# EAGLE board testtool (EAGLE 9.5.2)
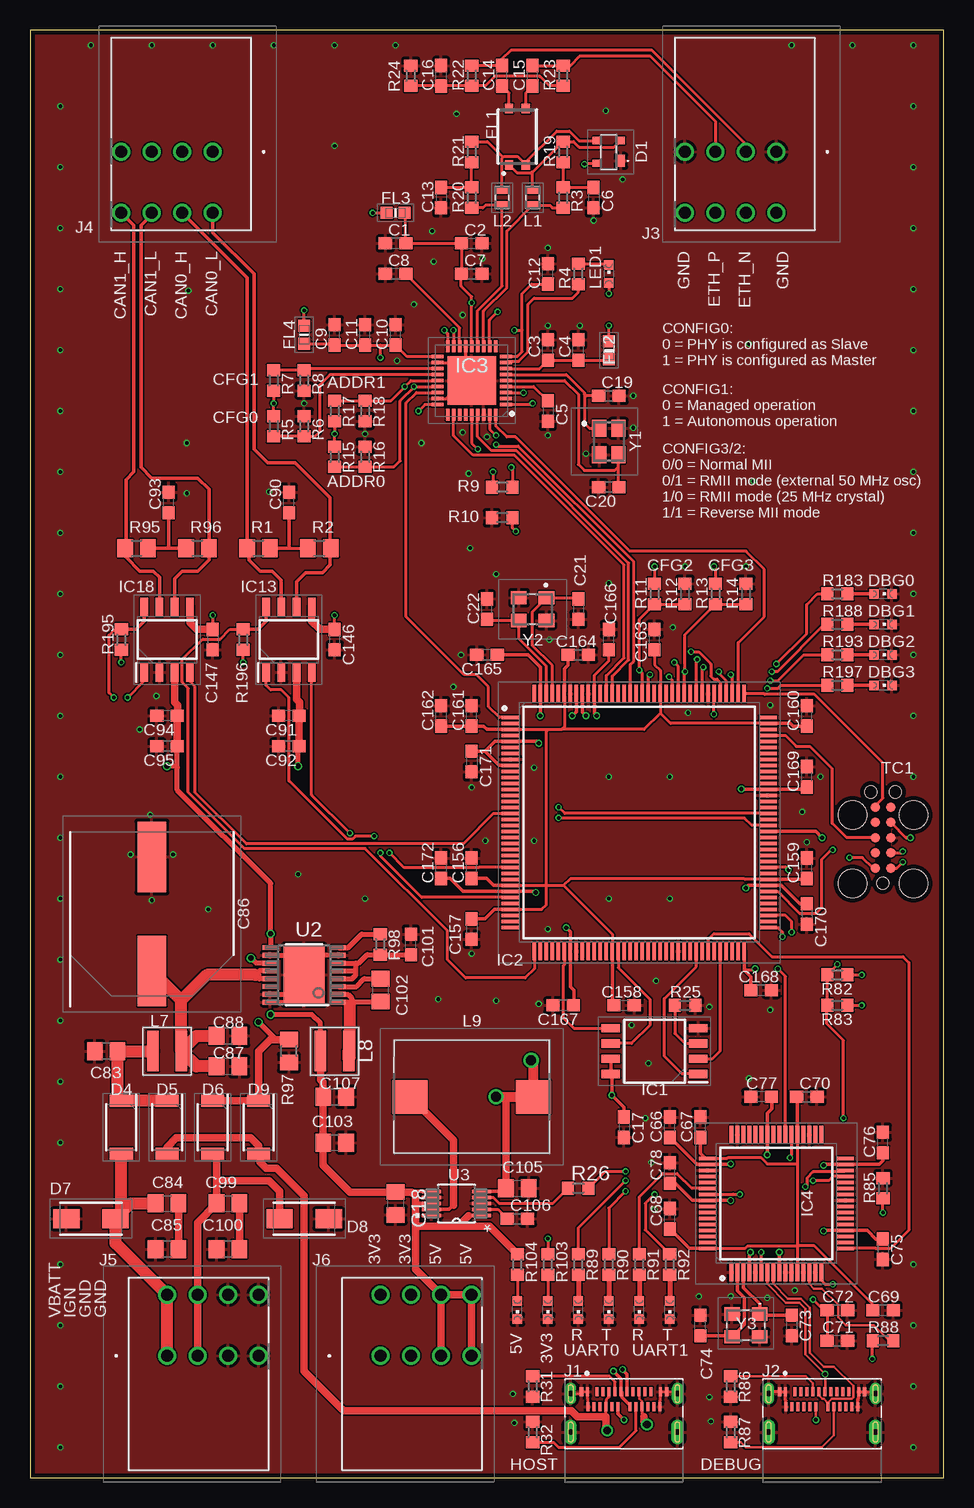
[diagram p7: board, top side]
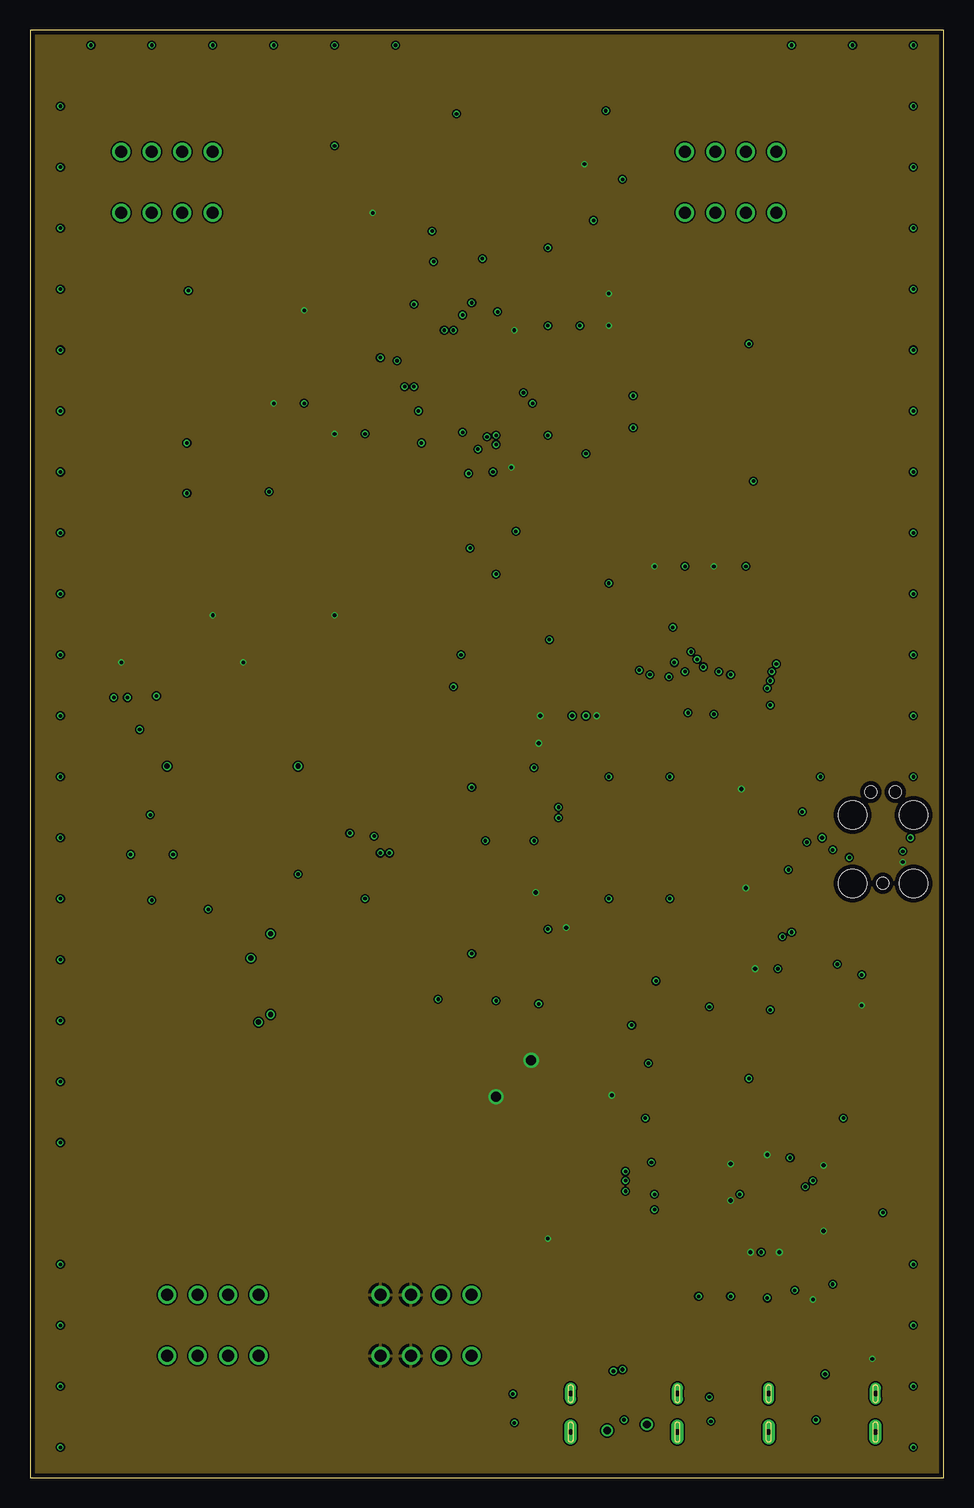
[diagram p8: board, inner layer Route2]
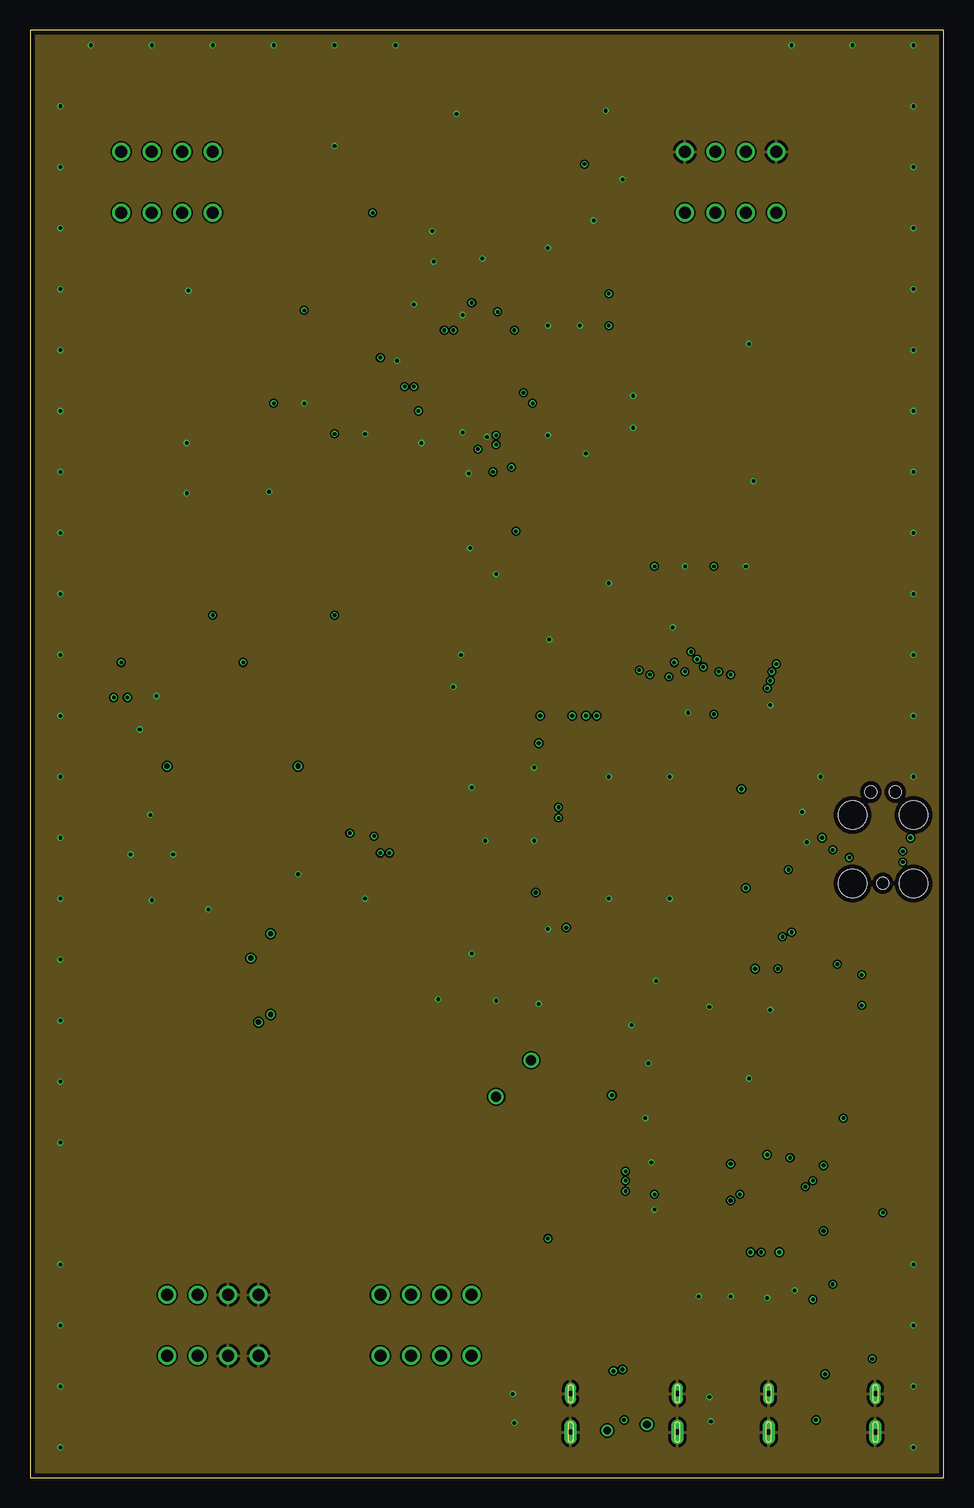
[diagram p9: board, inner layer Route15]
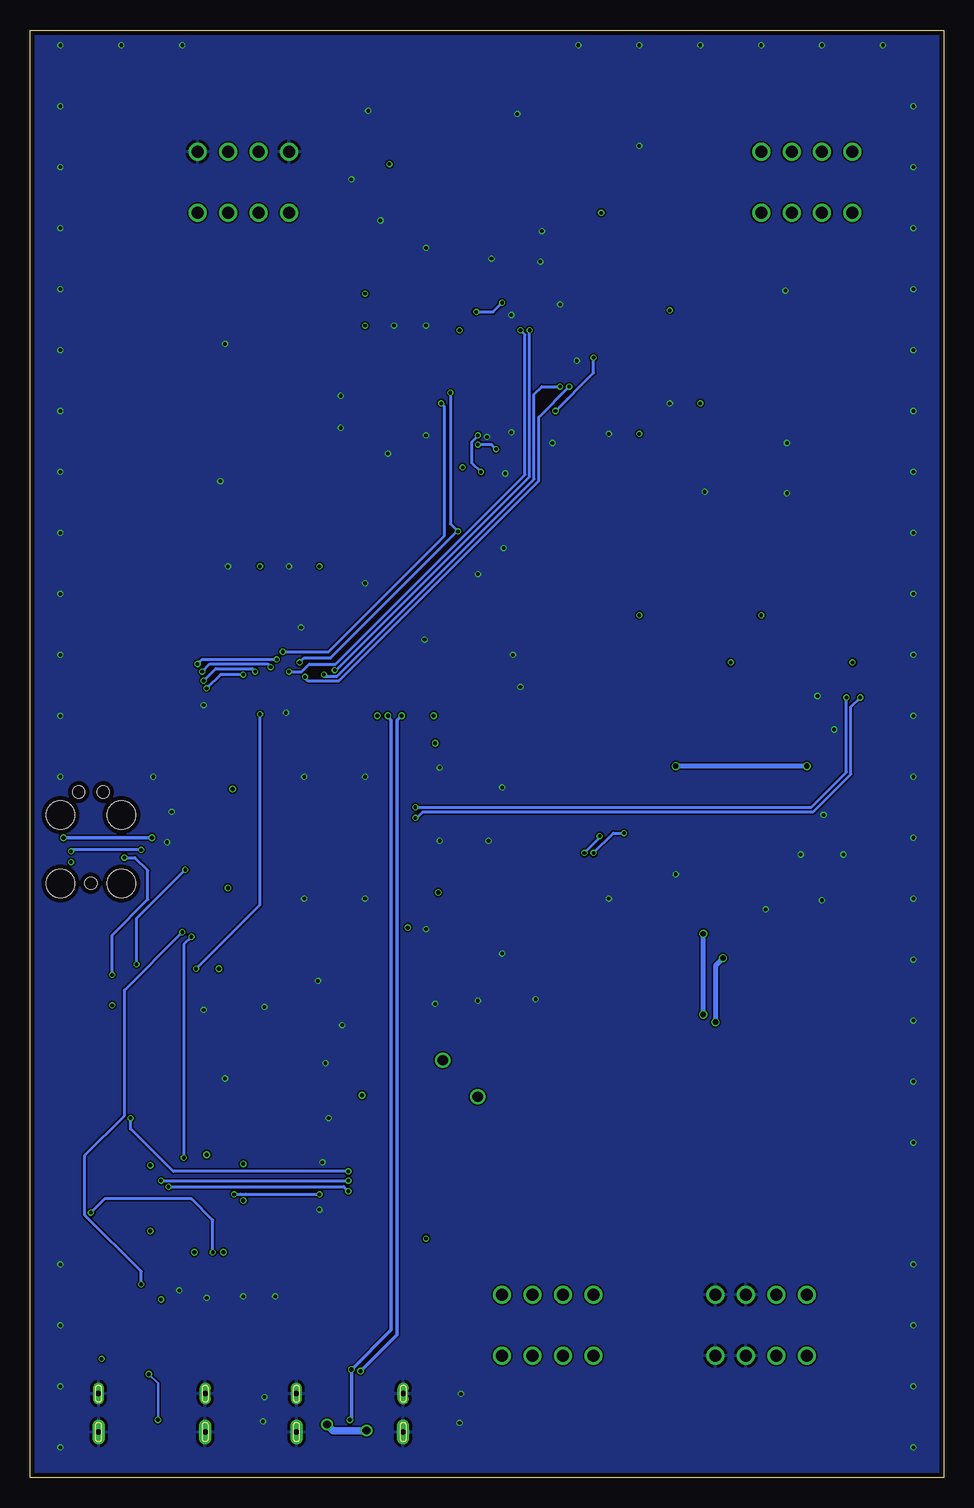
[diagram p10: board, bottom side, seen from below]

Size 76.2 x 120.65 mm. Coordinates in mm from the lower left corner, seen from the top.
Outline: 0,0 76.2,0 76.2,120.65 0,120.65 0,0
Copper layers (1*2*15*16): Top 0.035559375mm / dielectric 0.17018125mm / Route2 0.01778125mm / dielectric 47mil / Route15 0.01778125mm / dielectric 0.17018125mm / Bottom 0.035559375mm
Design rules "oshpark-4layer": minimum track width 5mil, minimum drill 10mil, track to track 5mil, track to pad 5mil, pad to pad 5mil, via to via 5mil, smd to smd 5mil, copper to edge 15mil, drill to drill 6mil, minimum pad ring 4mil, minimum via ring 4mil, stop-mask expansion 2.5mil, vias tented up to drill 0mil, thermal gap 10mil

## Footprints (pad centres in the part's own frame; a part is rotated, then mirrored left to right if it is on the bottom)
C0603 = smd 1.1 x 1: 1 -0.85,0; 2 0.85,0
C0805 = smd 1.3 x 1.5: 1 -0.95,0; 2 0.95,0
CAPAE1360X1450N = smd 5.9 x 2.4: 1 -4.75,0; 2 4.75,0
PESD2ETHAXR = smd 1 x 0.7: 1 -0.75,-1 | smd 0.6 x 0.7: 2 0.95,-1; 3 0.95,1; 4 -0.95,1
SODFL4725X110N = smd 1 x 1.93: 1 -2.2,0; 2 2.2,0
DIONM5127X229N = smd 2.2 x 1.55: 1 -2.05,0; 2 2.05,0
ACT45L_1 = smd 0.8 x 0.7: 1 -2.35,-0.7; 2 -2.35,0.7; 3 2.35,-0.7; 4 2.35,0.7
BEADC1608X95N = smd 1 x 1: 1 -0.75,0; 2 0.75,0
SOIC127P794X203-8N = smd 1.55 x 0.7: 1 -3.65,1.905; 2 -3.65,0.635; 3 -3.65,-0.635; 4 -3.65,-1.905; 5 3.65,-1.905; 6 3.65,-0.635; 7 3.65,0.635; 8 3.65,1.905
QFP50P2200X2200X160-144N = smd 1.475 x 0.3: 1 -10.738,8.75; 2 -10.738,8.25; 3 -10.738,7.75; 4 -10.738,7.25; 5 -10.738,6.75; 6 -10.738,6.25; 7 -10.738,5.75; 8 -10.738,5.25; 9 -10.738,4.75; 10 -10.738,4.25; 11 -10.738,3.75; 12 -10.738,3.25; 13 -10.738,2.75; 14 -10.738,2.25; 15 -10.738,1.75; 16 -10.738,1.25; 17 -10.738,0.75; 18 -10.738,0.25; 19 -10.738,-0.25; 20 -10.738,-0.75; 21 -10.738,-1.25; 22 -10.738,-1.75; 23 -10.738,-2.25; 24 -10.738,-2.75; 25 -10.738,-3.25; 26 -10.738,-3.75; 27 -10.738,-4.25; 28 -10.738,-4.75; 29 -10.738,-5.25; 30 -10.738,-5.75; 31 -10.738,-6.25; 32 -10.738,-6.75; 33 -10.738,-7.25; 34 -10.738,-7.75; 35 -10.738,-8.25; 36 -10.738,-8.75; 73 10.738,-8.75; 74 10.738,-8.25; 75 10.738,-7.75; 76 10.738,-7.25; 77 10.738,-6.75; 78 10.738,-6.25; 79 10.738,-5.75; 80 10.738,-5.25; 81 10.738,-4.75; 82 10.738,-4.25; 83 10.738,-3.75; 84 10.738,-3.25; 85 10.738,-2.75; 86 10.738,-2.25; 87 10.738,-1.75; 88 10.738,-1.25; 89 10.738,-0.75; 90 10.738,-0.25; 91 10.738,0.25; 92 10.738,0.75; 93 10.738,1.25; 94 10.738,1.75; 95 10.738,2.25; 96 10.738,2.75; 97 10.738,3.25; 98 10.738,3.75; 99 10.738,4.25; 100 10.738,4.75; 101 10.738,5.25; 102 10.738,5.75; 103 10.738,6.25; 104 10.738,6.75; 105 10.738,7.25; 106 10.738,7.75; 107 10.738,8.25; 108 10.738,8.75 | smd 0.3 x 1.475: 37 -8.75,-10.738; 38 -8.25,-10.738; 39 -7.75,-10.738; 40 -7.25,-10.738; 41 -6.75,-10.738; 42 -6.25,-10.738; 43 -5.75,-10.738; 44 -5.25,-10.738; 45 -4.75,-10.738; 46 -4.25,-10.738; 47 -3.75,-10.738; 48 -3.25,-10.738; 49 -2.75,-10.738; 50 -2.25,-10.738; 51 -1.75,-10.738; 52 -1.25,-10.738; 53 -0.75,-10.738; 54 -0.25,-10.738; 55 0.25,-10.738; 56 0.75,-10.738; 57 1.25,-10.738; 58 1.75,-10.738; 59 2.25,-10.738; 60 2.75,-10.738; 61 3.25,-10.738; 62 3.75,-10.738; 63 4.25,-10.738; 64 4.75,-10.738; 65 5.25,-10.738; 66 5.75,-10.738; 67 6.25,-10.738; 68 6.75,-10.738; 69 7.25,-10.738; 70 7.75,-10.738; 71 8.25,-10.738; 72 8.75,-10.738; 109 8.75,10.738; 110 8.25,10.738; 111 7.75,10.738; 112 7.25,10.738; 113 6.75,10.738; 114 6.25,10.738; 115 5.75,10.738; 116 5.25,10.738; 117 4.75,10.738; 118 4.25,10.738; 119 3.75,10.738; 120 3.25,10.738; 121 2.75,10.738; 122 2.25,10.738; 123 1.75,10.738; 124 1.25,10.738; 125 0.75,10.738; 126 0.25,10.738; 127 -0.25,10.738; 128 -0.75,10.738; 129 -1.25,10.738; 130 -1.75,10.738; 131 -2.25,10.738; 132 -2.75,10.738; 133 -3.25,10.738; 134 -3.75,10.738; 135 -4.25,10.738; 136 -4.75,10.738; 137 -5.25,10.738; 138 -5.75,10.738; 139 -6.25,10.738; 140 -6.75,10.738; 141 -7.25,10.738; 142 -7.75,10.738; 143 -8.25,10.738; 144 -8.75,10.738
QFN50P600X600X100-37N = smd 1 x 0.3: 1 -2.85,2; 2 -2.85,1.5; 3 -2.85,1; 4 -2.85,0.5; 5 -2.85,0; 6 -2.85,-0.5; 7 -2.85,-1; 8 -2.85,-1.5; 9 -2.85,-2; 19 2.85,-2; 20 2.85,-1.5; 21 2.85,-1; 22 2.85,-0.5; 23 2.85,0; 24 2.85,0.5; 25 2.85,1; 26 2.85,1.5; 27 2.85,2 | smd 0.3 x 1: 10 -2,-2.85; 11 -1.5,-2.85; 12 -1,-2.85; 13 -0.5,-2.85; 14 0,-2.85; 15 0.5,-2.85; 16 1,-2.85; 17 1.5,-2.85; 18 2,-2.85; 28 2,2.85; 29 1.5,2.85; 30 1,2.85; 31 0.5,2.85; 32 0,2.85; 33 -0.5,2.85; 34 -1,2.85; 35 -1.5,2.85; 36 -2,2.85 | smd 4.05 x 4.05: 37 0,0
QFP50P1200X1200X160-64N = smd 1.475 x 0.3: 1 -5.738,3.75; 2 -5.738,3.25; 3 -5.738,2.75; 4 -5.738,2.25; 5 -5.738,1.75; 6 -5.738,1.25; 7 -5.738,0.75; 8 -5.738,0.25; 9 -5.738,-0.25; 10 -5.738,-0.75; 11 -5.738,-1.25; 12 -5.738,-1.75; 13 -5.738,-2.25; 14 -5.738,-2.75; 15 -5.738,-3.25; 16 -5.738,-3.75; 33 5.738,-3.75; 34 5.738,-3.25; 35 5.738,-2.75; 36 5.738,-2.25; 37 5.738,-1.75; 38 5.738,-1.25; 39 5.738,-0.75; 40 5.738,-0.25; 41 5.738,0.25; 42 5.738,0.75; 43 5.738,1.25; 44 5.738,1.75; 45 5.738,2.25; 46 5.738,2.75; 47 5.738,3.25; 48 5.738,3.75 | smd 0.3 x 1.475: 17 -3.75,-5.738; 18 -3.25,-5.738; 19 -2.75,-5.738; 20 -2.25,-5.738; 21 -1.75,-5.738; 22 -1.25,-5.738; 23 -0.75,-5.738; 24 -0.25,-5.738; 25 0.25,-5.738; 26 0.75,-5.738; 27 1.25,-5.738; 28 1.75,-5.738; 29 2.25,-5.738; 30 2.75,-5.738; 31 3.25,-5.738; 32 3.75,-5.738; 49 3.75,5.738; 50 3.25,5.738; 51 2.75,5.738; 52 2.25,5.738; 53 1.75,5.738; 54 1.25,5.738; 55 0.75,5.738; 56 0.25,5.738; 57 -0.25,5.738; 58 -0.75,5.738; 59 -1.25,5.738; 60 -1.75,5.738; 61 -2.25,5.738; 62 -2.75,5.738; 63 -3.25,5.738; 64 -3.75,5.738
SOIC127P602X173-8N = smd 1.55 x 0.65: 1 -2.725,1.905; 2 -2.725,0.635; 3 -2.725,-0.635; 4 -2.725,-1.905; 5 2.725,-1.905; 6 2.725,-0.635; 7 2.725,0.635; 8 2.725,1.905
TE_2305018-2 = smd 0.25 x 0.75: A1 -3.05,3.375; A2 -2.25,3.375; A3 -1.75,3.375; A4 -1.25,3.375; A5 -0.75,3.375; A6 -0.25,3.375; A7 0.25,3.375; A8 0.75,3.375; A9 1.25,3.375; A10 1.75,3.375; A11 2.25,3.375; A12 3.05,3.375; B1 3,2.125; B2 2.5,2.125; B3 2,2.125; B4 1.5,2.125; B5 1,2.125; B6 0.5,2.125; B7 -0.5,2.125; B8 -1,2.125; B9 -1.5,2.125; B10 -2,2.125; B11 -2.5,2.125; B12 -3,2.125 | smd 0.3 x 0.75: G1 -3.55,3.375; G2 3.55,3.375 | drill 0.45 pad 1.025 long: S1 -4.45,0; S2 4.45,0 | drill 0.45 pad 0.925 long: S3 -4.45,3.2; S4 4.45,3.2
TBL00925404GY2GY = drill 1 pad 1.5: 1 0,0; 2 0,5.08; 3 2.54,0; 4 2.54,5.08; 5 5.08,0; 6 5.08,5.08; 7 7.62,0; 8 7.62,5.08
0603CS82NXGLW = smd 1.02 x 0.64: 1 0,0.64; 2 0,-0.64
XAL40XX = smd 0.98 x 3.4: 1 -1.185,0; 2 1.185,0
DO3316P103MLB = smd 2.92 x 2.79: 1 -5.145,0; 2 5.145,0
CHIPLED_0603 = smd 0.8 x 0.8: A 0,-0.75; C 0,0.75
R0805 = smd 1.3 x 1.5: 1 -0.95,0; 2 0.95,0
R0603 = smd 1 x 1.1: 1 -0.85,0; 2 0.85,0
TC2050-IDC = smd 0.787 x 0.787: 1 -2.54,-0.635; 2 -1.27,-0.635; 3 0,-0.635; 4 1.27,-0.635; 5 2.54,-0.635; 6 2.54,0.635; 7 1.27,0.635; 8 0,0.635; 9 -1.27,0.635; 10 -2.54,0.635 | hole 0.991: -3.81,0; 3.81,1.016; 3.81,-1.016 | hole 2.375: -3.81,2.54; -3.81,-2.54; 1.905,2.54; 1.905,-2.54
PWP0016K_L = smd 1.2 x 0.4: 1 -2.85,2.275; 2 -2.85,1.625; 3 -2.85,0.975; 4 -2.85,0.325; 5 -2.85,-0.325; 6 -2.85,-0.975; 7 -2.85,-1.625; 8 -2.85,-2.275; 9 2.85,-2.275; 10 2.85,-1.625; 11 2.85,-0.975; 12 2.85,-0.325; 13 2.85,0.325; 14 2.85,0.975; 15 2.85,1.625; 16 2.85,2.275 | smd 3.4 x 5: 17 0,0 | smd 0.5 x 0.5: V 0,1.8
DGS10 = smd 1.575 x 0.279: 1 -2.095,1; 2 -2.095,0.5; 3 -2.095,0; 4 -2.095,-0.5; 5 -2.095,-1; 6 2.095,-1; 7 2.095,-0.5; 8 2.095,0; 9 2.095,0.5; 10 2.095,1
NX3225SA25MHZEXS00ACS11338 = smd 1.4 x 1.2: 1 -1.1,-0.8; 2 1.1,-0.8; 3 1.1,0.8; 4 -1.1,0.8
ABM8AIG12000MHZ12D2ZT = smd 1.3 x 1.1: 1 -1.15,-0.95; 2 1.15,-0.95; 3 1.15,0.95; 4 -1.15,0.95
ABM8AIG25000MHZ122ZT3 = smd 1.3 x 1.1: 1 -1.15,-0.95; 2 1.15,-0.95; 3 1.15,0.95; 4 -1.15,0.95

## Placement (x,y rotation side)
C1  10uF  [C0603]  30.48,102.87 180 top
C2  100nF  [C0603]  36.83,102.87 0 top
C3  10uF  [C0603]  43.18,93.98 90 top
C4  1uF  [C0603]  45.72,93.98 90 top
C5  1uF  [C0603]  43.18,88.9 270 top
C6  47pF  [C0603]  46.99,106.68 270 top
C7  100nF  [C0603]  36.83,100.33 0 top
C8  1uF  [C0603]  30.48,100.33 180 top
C9  10uF  [C0603]  25.4,95.25 90 top
C10  100nF  [C0603]  30.48,95.25 90 top
C11  100nF  [C0603]  27.94,95.25 90 top
C12  1uF  [C0603]  43.18,100.33 90 top
C13  47pF  [C0603]  34.29,106.68 270 top
C14  100nF  [C0603]  39.37,116.84 90 top
C15  100nF  [C0603]  41.91,116.84 90 top
C16  4.7nF  [C0603]  34.29,116.84 90 top
C17  100nF  [C0603]  49.53,29.21 270 top
C18  10uF  [C0805]  30.48,22.86 270 top
C19  8.2pF  [C0603]  48.26,90.17 0 top
C20  8.2pF  [C0603]  48.26,82.55 180 top
C21  12pF  [C0603]  45.72,72.39 270 top
C22  12pF  [C0603]  38.1,72.39 90 top
C66  100nF  [C0603]  53.34,29.21 90 top
C67  3.3uF  [C0603]  55.88,29.21 90 top
C68  100nF  [C0603]  53.34,21.59 90 top
C69  100nF  [C0603]  71.12,13.97 0 top
C70  100nF  [C0603]  64.77,31.75 0 top
C71  4.7uF  [C0603]  67.31,11.43 0 top
C72  4.7uF  [C0603]  67.31,13.97 0 top
C73  18nF  [C0603]  63.5,12.7 270 top
C74  18nF  [C0603]  55.88,12.7 90 top
C75  100nF  [C0603]  71.12,19.05 270 top
C76  100nF  [C0603]  71.12,27.94 90 top
C77  100nF  [C0603]  60.96,31.75 180 top
C78  100nF  [C0603]  53.34,25.4 90 top
C83  0.47uF  [C0805]  6.35,35.56 180 top
C84  470pF  [C0805]  11.43,22.86 0 top
C85  470pF  [C0805]  11.43,19.05 180 top
C86  UCZ1K151MNQ1MS  [CAPAE1360X1450N]  10.16,46.99 90 top
C87  10uF  [C0805]  16.51,34.29 0 top
C88  0.47uF  [C0805]  16.51,36.83 0 top
C90  4.7nF  [C0603]  21.59,81.28 90 top
C91  100nF  [C0603]  21.59,63.5 180 top
C92  10uF  [C0603]  21.59,60.96 180 top
C93  4.7nF  [C0603]  11.56,81.28 90 top
C94  100nF  [C0603]  11.43,63.5 180 top
C95  10uF  [C0603]  11.43,60.96 180 top
C99  470pF  [C0805]  16.51,22.86 0 top
C100  470pF  [C0805]  16.51,19.05 180 top
C101  0.47uF  [C0603]  31.75,44.45 90 top
C102  220nF  [C0805]  29.21,40.64 270 top
C103  10uF  [C0805]  25.4,27.94 0 top
C105  10uF  [C0805]  40.64,24.13 0 top
C106  1uF  [C0603]  40.64,21.59 0 top
C107  10uF  [C0805]  25.4,31.75 0 top
C146  100nF  [C0603]  25.4,69.85 270 top
C147  100nF  [C0603]  15.24,69.85 270 top
C156  100nF  [C0603]  36.83,50.8 90 top
C157  100nF  [C0603]  36.83,45.72 270 top
C158  100nF  [C0603]  49.53,39.37 0 top
C159  100nF  [C0603]  64.77,50.8 90 top
C160  100nF  [C0603]  64.77,63.5 90 top
C161  100nF  [C0603]  36.83,63.5 90 top
C162  1uF  [C0603]  34.29,63.5 90 top
C163  100nF  [C0603]  52.07,69.85 90 top
C164  100nF  [C0603]  45.72,68.58 0 top
C165  4.7uF  [C0603]  38.1,68.58 180 top
C166  100nF  [C0603]  48.26,69.85 90 top
C167  100nF  [C0603]  44.45,39.37 180 top
C168  100nF  [C0603]  60.96,40.64 0 top
C169  100nF  [C0603]  64.77,58.42 90 top
C170  100nF  [C0603]  64.77,46.99 270 top
C171  100nF  [C0603]  36.83,59.69 270 top
C172  100nF  [C0603]  34.29,50.8 90 top
D1  PESD2ETH-AXR  [PESD2ETHAXR]  48.26,110.49 90 top
D4  PMEG3030EP,115  [SODFL4725X110N]  7.62,29.21 270 top
D5  PMEG3030EP,115  [SODFL4725X110N]  11.43,29.21 270 top
D6  PMEG3030EP,115  [SODFL4725X110N]  15.24,29.21 270 top
D7  SMAJ24CA-Q  [DIONM5127X229N]  5.08,21.59 0 top
D8  SMAJ24CA-Q  [DIONM5127X229N]  22.86,21.59 180 top
D9  PMEG3030EP,115  [SODFL4725X110N]  19.05,29.21 270 top
FL1  ACT45L-201-2P-TL000  [ACT45L_1]  40.64,111.76 90 top
FL2  BLM18PG330SN1D  [BEADC1608X95N]  48.26,93.98 270 top
FL3  BLM18PG330SN1D  [BEADC1608X95N]  30.48,105.41 0 top
FL4  BLM18PG330SN1D  [BEADC1608X95N]  22.86,95.25 270 top
IC1  SST26VF032BT-104I_SM  [SOIC127P794X203-8N]  52.07,35.56 180 top
IC2  ATSAMV71Q21B-AABT  [QFP50P2200X2200X160-144N]  50.8,54.61 0 top
IC3  TJA1100HNZ  [QFN50P600X600X100-37N]  36.83,91.44 180 top
IC4  FT2232HL  [QFP50P1200X1200X160-64N]  62.23,22.86 90 top
IC13  TLE9250XSJXUMA1  [SOIC127P602X173-8N]  21.59,69.85 90 top
IC18  TLE9250XSJXUMA1  [SOIC127P602X173-8N]  11.43,69.85 90 top
J1  2305018-2  [TE_2305018-2]  49.53,3.81 0 top
J2  2305018-2  [TE_2305018-2]  66.04,3.81 0 top
J3  TBL009-254-04GY-2GY  [TBL00925404GY2GY]  62.23,110.49 180 top
J4  TBL009-254-04GY-2GY  [TBL00925404GY2GY]  15.24,110.49 180 top
J5  TBL009-254-04GY-2GY  [TBL00925404GY2GY]  11.43,10.16 0 top
J6  TBL009-254-04GY-2GY  [TBL00925404GY2GY]  29.21,10.16 0 top
L1  0603CS-R12XGLU  [0603CS82NXGLW]  41.91,106.68 180 top
L2  0603CS-R12XGLU  [0603CS82NXGLW]  39.37,106.68 180 top
L7  XAL4020-102MEC  [XAL40XX]  11.43,35.56 0 top
L8  XAL4040-103MEC  [XAL40XX]  25.4,35.56 180 top
L9  DO3316P-103MLB  [DO3316P103MLB]  36.83,31.75 180 top
LED1  [CHIPLED_0603]  48.26,100.33 0 top
LED4  [CHIPLED_0603]  45.72,13.97 180 top
LED5  [CHIPLED_0603]  48.26,13.97 180 top
LED6  [CHIPLED_0603]  50.8,13.97 180 top
LED7  [CHIPLED_0603]  53.34,13.97 180 top
LED11  [CHIPLED_0603]  43.18,13.97 180 top
LED12  [CHIPLED_0603]  40.64,13.97 180 top
LED13  [CHIPLED_0603]  71.12,73.66 270 top
LED14  [CHIPLED_0603]  71.12,71.12 270 top
LED15  [CHIPLED_0603]  71.12,68.58 270 top
LED16  [CHIPLED_0603]  71.12,66.04 270 top
R1  60  [R0805]  19.05,77.47 0 top
R2  60  [R0805]  24.13,77.47 0 top
R3  49.9  [R0603]  44.45,106.68 90 top
R4  1k  [R0603]  45.72,100.33 90 top
R5  10k  [R0603]  20.32,87.63 90 top
R6  DNP  [R0603]  22.86,87.63 90 top
R7  10k  [R0603]  20.32,91.44 270 top
R8  DNP  [R0603]  22.86,91.44 270 top
R9  5.11k  [R0603]  39.37,82.55 0 top
R10  10k  [R0603]  39.37,80.01 180 top
R11  DNP  [R0603]  52.07,73.66 90 top
R12  10k  [R0603]  54.61,73.66 90 top
R13  10k  [R0603]  57.15,73.66 90 top
R14  DNP  [R0603]  59.69,73.66 90 top
R15  DNP  [R0603]  25.4,85.09 90 top
R16  10k  [R0603]  27.94,85.09 90 top
R17  DNP  [R0603]  25.4,88.9 270 top
R18  10k  [R0603]  27.94,88.9 270 top
R19  49.9  [R0603]  44.45,110.49 90 top
R20  49.9  [R0603]  36.83,106.68 90 top
R21  49.9  [R0603]  36.83,110.49 90 top
R22  1k  [R0603]  36.83,116.84 90 top
R23  1k  [R0603]  44.45,116.84 90 top
R24  100k  [R0603]  31.75,116.84 270 top
R25  10k  [R0603]  54.61,39.37 0 top
R26  0  [R0603]  45.72,24.13 0 top
R31  5.11k  [R0603]  41.91,7.62 90 top
R32  5.11k  [R0603]  41.91,3.81 270 top
R82  0  [R0603]  67.31,41.91 180 top
R83  10k  [R0603]  67.31,39.37 180 top
R85  12k  [R0603]  71.12,24.13 90 top
R86  5.11k  [R0603]  58.42,7.62 90 top
R87  5.11k  [R0603]  58.42,3.81 270 top
R88  12k  [R0603]  71.12,11.43 0 top
R89  12k  [R0603]  45.72,17.78 270 top
R90  12k  [R0603]  48.26,17.78 270 top
R91  12k  [R0603]  50.8,17.78 270 top
R92  12k  [R0603]  53.34,17.78 270 top
R95  60  [R0805]  8.89,77.47 0 top
R96  60  [R0805]  13.97,77.47 0 top
R97  1k  [R0805]  21.59,35.56 90 top
R98  10k  [R0603]  29.21,44.45 270 top
R103  10k  [R0603]  43.18,17.78 270 top
R104  10k  [R0603]  40.64,17.78 270 top
R183  10k  [R0603]  67.31,73.66 0 top
R188  10k  [R0603]  67.31,71.12 0 top
R193  10k  [R0603]  67.31,68.58 0 top
R195  10k  [R0603]  7.62,69.85 90 top
R196  10k  [R0603]  17.78,69.85 90 top
R197  10k  [R0603]  67.31,66.04 0 top
TC1  TC2050-IDC  [TC2050-IDC]  71.12,53.34 90 top
U2  LM63625  [PWP0016K_L]  22.86,41.91 180 top
U3  TPS62007-Q1_DGS_10  [DGS10]  35.56,22.86 180 top
Y1  NX3225SA-25MHZ-EXS00A-CS11338  [NX3225SA25MHZEXS00ACS11338]  48.26,86.36 270 top
Y2  ABM8AIG-12.000MHZ-12-D2Z-T  [ABM8AIG12000MHZ12D2ZT]  41.91,72.39 180 top
Y3  ABM8AIG-12.000MHZ-1Z-T  [ABM8AIG25000MHZ122ZT3]  59.69,12.7 180 top

## Tracks (layer width: path | path; a pad name or v marks a point on that pad's centre or on a via)
3V3_SUPPLY_PGOOD
  Top 0.254: U3.4 38.62,23.36 39.12,22.86 43.6,22.86 R26.1
5V_SUPPLY_PGOOD
  Top 0.406: U2.8 26.53,44.19 27.65,45.3 R98.1
+3V3  (via drill 0.3, 0.35, 0.85)
  Top 0.254: v43.18,19.94 R103.1 | IC2.134 47.05,66.86 48.26,68.07 C166.1 | 60.44,42.41 60.34,42.3 59.55,42.3 | C72.1 66.46,13.84 | 66.46,13.84 C71.1 | v65.28,14.86 66.29,13.84 66.46,13.84 | v70.23,9.91 70.23,11.39 R88.1 | R83.1 v69.34,39.37 | v72.77,51.31 72.26,50.8 TC1.1 | v15.24,71.88 C147.1 | v17.78,67.94 R196.1 | v7.62,67.94 R195.1 | C146.1 v25.4,71.88 | FL2.1 v48.26,96.01 | IC3.9 39.71,93.47 40.64,93.47 41.02,93.85 41.02,95.63 | 41.02,95.63 41.02,98.68 41.82,99.48 C12.1 | v40.39,95.63 41.02,95.63 | LED1.A v48.26,98.68 | FL4.1 v22.86,97.28 | R7.2 v20.32,89.53 R5.2 | R17.2 v25.4,87 R15.2 | v52.07,75.95 R11.2 | v57.02,75.95 57.15,75.82 R13.2 | v28.57,105.41 FL3.1 | v46.23,109.47 46.29,109.54 D1.4 | v40.13,84.2 40.22,84.11 R9.2
  Top 0.305: C76.1 71.12,26.42 70.81,26.11 IC4.31 66.24,26.11 v66.17,26.04 | C75.1 70.52,19.9 69.81,20.61 IC4.20 66.19,20.61 66.15,20.57 v66.17,20.57 | C78.1 53.81,24.55 55.25,23.11 IC4.56 v58.42,23.11 | C66.1 55.59,26.11 IC4.50 58.37,26.11 v58.42,26.16 | C77.1 61.85,31.71 61.85,30.73 61.48,30.36 IC4.42 61.48,26.95 61.47,26.93 v61.47,26.92 | C170.1 64.17,47.84 62.65,49.36 IC2.80 59.9,49.36 v59.69,49.15 | C169.1 64.56,57.36 IC2.96 59.35,57.36 v59.31,57.4 | C167.1 45.34,39.41 45.34,40.64 45.05,40.93 IC2.43 45.05,45.5 v44.7,45.85 | IC2.72 59.55,42.3 60.11,41.74 C168.1 | C165.1 41.53,68.58 42.55,67.56 IC2.143 v42.55,63.51 v42.55,63.5 | 37.93,60.54 C171.1 | 37.93,60.54 38.75,61.36 IC2.5 42.27,61.36 v42.42,61.21 | C172.1 35.01,49.95 36.1,48.86 IC2.30 42.07,48.86 v42.16,48.77 | IC4.9 v62.48,18.79 v62.48,18.8 | IC4.4 59.98,18.7 v60.07,18.8 | C17.1 49.53,30.86 v48.51,31.88 48.51,33.56 IC1.8 IC1.7 | IC2.134 47.05,63.69 v47.24,63.5 | v60.45,42.42 60.44,42.41 | U3.5 39.42,23.86 C105.1 | IC2.9 39.11,59.36 37.93,60.54
  Top 0.61: IC18.5 13.34,71.25 13.88,70.7 C147.1 | IC13.5 23.5,71.37 24.17,70.7 C146.1 | C105.1 39.69,31.69 39.75,31.75
  Top 0.813: L9.1 41.98,34.61 v41.78,34.8 | v38.86,31.75 39.75,31.75 L9.1 | 41.91,31.75 L9.1
  pour Route2: -6.35,125.73 81.28,125.73 81.28,-3.81 -6.35,-3.81
+5V  (via drill 0.45)
  Top 0.305: U3.6 31.87,23.86 31.82,23.81 | U3.8 32.26,22.86 32.13,22.99 | U3.1 36.59,21.86 36.58,21.84
  Top 0.406: L8.2 24.21,37.89 23.5,38.61 v20.07,38.61 | U2.9 20.07,44.24 v20.07,45.34 20.07,49.53 12.28,57.32 12.28,59.18 | 12.28,59.18 C95.1 | 12.28,59.18 12.15,59.31 v11.43,59.31 | v22.35,59.31 22.35,60.87 C92.1
  Top 0.61: L8.2 24.21,33.19 24.45,32.95 C107.1 C103.1 24.45,26.03 26.67,23.81 C18.1 31.82,23.81 32.13,23.5 32.13,22.99 32.13,20.95 | IC18.3 12.06,64.64 12.32,64.39 12.32,63.54 C94.1 C95.1 | IC13.3 22.23,64.9 22.48,64.64 22.48,63.54 C91.1 C92.1 | 34.42,15.24 J6.8 J6.7 | 34.42,15.24 J6.6 32.13,17.4 32.13,20.95 | J6.5 34.29,15.11 34.42,15.24 | 36.58,21.84 35.69,20.95 | 35.69,20.95 32.13,20.95 | R104.1 38.31,20.95 35.69,20.95
  Bottom 0.406: v20.07,38.61 v20.07,45.34 | v11.43,59.31 v22.35,59.31
CAN0_H
  Top 0.305: J4.4 18.1,100.01 R1.1 18.29,77.28 18.29,76.45 19.18,75.56 20.19,75.56 20.95,74.8 IC13.7
CAN0_L
  Top 0.254: R2.2 25.02,77.47
  Top 0.305: J4.2 15.24,103.76 18.67,100.33 18.67,85.72 19.81,84.58 22.1,84.58 25.02,81.66 25.02,77.47 25.02,76.07 24.38,75.44 22.99,75.44 22.23,74.68 IC13.6
CAN0_RW_MODE
  Top 0.254: IC2.37 42.05,42.43 41.27,41.66 36.32,41.66 34.8,43.18 34.8,45.59 27.95,52.44 17.89,52.44 13.21,57.12 13.21,65.79 12.7,66.3 12.7,68.2 14.4,69.9 15.85,69.9 16.65,70.7 17.91,70.7
  Top 0.305: IC13.8 19.68,71.37 19.01,70.7 17.91,70.7 R196.2
CAN0_RX  (via drill 0.3)
  Top 0.254: IC2.31 32.67,48.36 29.21,51.82 v29.21,52.07 | v26.67,53.72 23.5,56.9 IC13.4
  Bottom 0.254: v29.21,52.07 27.56,53.72 v26.67,53.72
CAN0_TX  (via drill 0.3)
  Top 0.254: IC2.26 37.45,50.86 37.44,50.85 31.2,50.85 v29.97,52.07 | v28.7,53.47 27.13,53.47 26.88,53.22 26.46,53.22 21.59,58.09 21.59,65.02 20.95,65.66 20.07,65.66 19.68,66.04 IC13.1
  Bottom 0.254: v29.97,52.07 28.7,53.34 v28.7,53.47
CAN1_H
  Top 0.305: J4.8 8.64,104.39 8.64,83.82 8,83.19 8,77.41 | IC18.7 10.79,75.06 10.29,75.56 9.14,75.56 8,76.71 8,77.34 8,77.41 | R95.1 8,77.41
CAN1_L
  Top 0.305: J4.6 10.16,105.28 9.27,104.39 9.27,84.2 10.16,83.31 13.97,83.31 14.92,82.36 R96.2 14.92,76.52 13.97,75.56 12.7,75.56 12.06,74.93 IC18.6
CAN1_RW_MODE  (via drill 0.3)
  Top 0.254: IC2.90 60.19,54.36 59.58,54.98 44.08,54.98 v44.07,54.99 | v6.99,65.02 6.6,65.41 6.6,70.23 7.07,70.7 R195.2
  Top 0.305: IC18.8 9.53,71.37 8.85,70.7 R195.2
  Bottom 0.254: v44.07,54.99 43.94,54.99 43.43,55.5 10.89,55.5 7.75,58.64 7.75,64.26 v6.99,65.02
CAN1_RX
  Top 0.254: IC18.4 13.34,66.36 13.72,65.98 13.72,57.15 18.05,52.82 36.12,52.82 38.66,55.36 IC2.17
CAN1_TX  (via drill 0.3)
  Top 0.254: IC2.92 44.59,55.36 v44.07,55.88 | v8.13,65.02 9.53,66.42 IC18.1
  Bottom 0.254: v44.07,55.88 11.05,55.88 8.13,58.8 v8.13,65.02
CON_ETH_TRX_M
  Top 0.254: J3.3 59.69,111.12 51.82,119 40.13,119 39.37,118.24 C14.2 R22.2
CON_ETH_TRX_P
  Top 0.254: C15.2 R23.2 45.05,117.69 45.85,118.49 51.69,118.49 57.15,113.03 J3.5
DEBUG_LED0  (via drill 0.3)
  Top 0.254: IC2.117 55.55,68.12 v55.63,68.2 | v62.23,67.82 64.77,70.36 64.77,72.77 65.66,73.66 R183.1
  Bottom 0.254: v62.23,67.82 61.85,68.2 v55.63,68.2
DEBUG_LED1  (via drill 0.3)
  Top 0.254: IC2.116 56.05,67.48 v56.13,67.56 | v61.85,67.19 62.31,67.19 66.25,71.12 R188.1
  Bottom 0.254: v61.85,67.19 61.22,67.82 56.39,67.82 v56.13,67.56
DEBUG_LED2  (via drill 0.3)
  Top 0.254: IC2.112 58.05,66.41 57.42,67.04 v57.42,67.18 | v61.72,66.42 62.36,66.42 64.52,68.58 R193.1
  Bottom 0.254: v57.42,67.18 57.67,67.44 60.71,67.44 v61.72,66.42
DEBUG_LED3  (via drill 0.3)
  Top 0.254: IC2.111 58.55,66.8 v58.42,66.93 | v61.47,65.79 62.36,65.79 62.61,66.04 R197.1
  Bottom 0.254: v58.42,66.93 60.33,66.93 v61.47,65.79
DEBUG_USB_DM  (via drill 0.35)
  Top 0.203: IC4.7 61.47,16.16 63.03,14.61 64.14,14.61 64.64,14.1 64.64,10.29 v66.29,8.64 J2.A7 | J2.B7 65.54,5.21 65.53,5.21 v65.53,4.83
  Bottom 0.203: v65.53,4.83 65.53,7.87 v66.29,8.64
DEBUG_USB_DP
  Top 0.203: IC4.8 61.97,16.16 63.2,14.94 64.27,14.94 65.02,14.18 65.02,10.41 66.17,9.27 67.03,9.27 68.64,7.66 68.64,6.71 68.51,6.58 66.86,6.58 66.54,6.26 66.54,6.22 | 66.54,6.22 J2.B6 | 66.54,6.22 66.18,6.58 66.07,6.58 65.79,6.86 J2.A6
ETH_MDC  (via drill 0.3)
  Top 0.254: v55.12,68.83 55.75,68.83 56.77,67.82 56.77,66.8 57.02,66.55 57.28,66.55 57.55,66.28 IC2.113 | v41.91,89.53 41.78,89.41 39.71,89.41 IC3.1
  Bottom 0.254: v55.12,68.83 51.31,68.83 41.66,78.49 41.66,89.28 v41.91,89.53
ETH_MDIO
  Top 0.254: IC3.36 38.83,87.66 39.75,86.74 40.48,86.74 50,77.22 59.69,77.22 61.21,75.69 61.21,71.75 59.05,69.59 IC2.110
FLASH_WP
  Top 0.254: R25.1 53.76,37.05 54.61,36.2 IC1.3
FTDI_OSCI
  Top 0.305: IC4.2 58.98,15.57 59.56,14.99 59.56,12.77 Y3.3 58.44,11.85 C74.1
FTDI_OSCO
  Top 0.305: IC4.3 59.48,15.85 60.84,14.48 Y3.1 60.94,13.55 C73.1
GND  (via drill 0.3)
  Top 0.203: J1.B12 46.53,6.56 46.48,6.61 J1.A1 J1.G1 45.8,7.01 J1.S3 | J1.B1 52.53,6.43 52.58,6.48 J1.A12 J1.G2 53.8,7.18 J1.S4
  Top 0.254: J2.S3 61.77,7.18 J2.G1 J2.A1 62.99,6.48 63.04,6.43 J2.B12 | J2.B1 69.04,6.56 69.09,6.61 J2.A12 J2.G2 70.31,7.18 J2.S4 | IC3.15 36.33,92.83 36.83,92.33 36.83,92.08 | 36.83,92.08 36.83,91.82 | 36.83,91.82 IC3.37 | IC3.20 35.28,92.94 35.31,92.96 35.69,92.96 36.83,91.82 | IC3.26 34.7,89.94 36.83,92.08
  Top 0.406: U2.7 24.48,43.53 23.56,42.61 | 23.56,42.61 U2.17 | U2.16 22.04,39.63 22.04,40.11 22.86,40.93 U2.17 | U2.15 21.23,40.28 U2.17 | U2.10 22.63,43.53 23.56,42.61
  other vias: 54.61,75.95 59.69,75.95 53.59,70.87 54.86,63.75 38.1,86.74 2.54,2.54 2.54,7.62 2.54,12.7 2.54,17.78 2.54,27.94 2.54,33.02 2.54,38.1 2.54,43.18 2.54,48.26 2.54,53.34 2.54,58.42 2.54,63.5 2.54,68.58 2.54,73.66 2.54,78.74 2.54,83.82 2.54,88.9 2.54,93.98 2.54,99.06 2.54,104.14 2.54,109.22 2.54,114.3 5.08,119.38 10.16,119.38 15.24,119.38 20.32,119.38 25.4,119.38 30.48,119.38 73.66,119.38 68.58,119.38 63.5,119.38 73.66,114.3 73.66,109.22 73.66,104.14 73.66,99.06 73.66,93.98 73.66,88.9 73.66,83.82 73.66,78.74 73.66,73.66 73.66,68.58 73.66,63.5 73.66,58.42 73.66,2.54 73.66,7.62 73.66,12.7 73.66,17.78 48.26,58.42 53.34,58.42 48.26,48.26 53.34,48.26 43.18,45.72 42.04,53.09 37.97,53.09 42.04,59.18 36.83,57.53 35.31,65.91 35.94,68.58 48.26,74.55 43.31,69.85 38.86,75.31 36.58,83.69 36.7,77.47 32.64,86.23 27.94,87 22.86,89.53 32,97.79 37.72,101.6 33.66,101.35 33.53,103.89 43.18,102.49 46.99,104.78 49.4,108.2 48.01,113.92 35.56,113.67 25.4,111 13.21,98.93 13.08,86.23 13.08,82.04 19.94,82.17 22.35,50.29 14.86,47.37 27.94,48.26 8.38,51.94 11.94,51.94 10.16,48.13 10.03,55.24 9.14,62.36 10.54,65.15 34.04,39.88 38.86,39.75 42.42,39.5 36.83,43.69 61.72,38.99 59.94,33.27 56.64,39.24 51.56,34.54 50.16,37.72 52.2,41.4 40.39,4.57 40.26,6.99 56.64,6.73 56.77,4.7 59.94,94.49 60.33,83.06 43.18,86.87 50.29,87.5 50.29,90.17 46.35,85.34 45.85,96.01 43.18,96.01 30.61,93.09 36.07,96.9 36.07,87.12 63.75,15.62 58.42,15.11 55.75,15.11 52.07,22.35 51.82,26.29 51.31,29.97 61.72,64.39 65.91,58.42 64.77,52.96 64.39,55.5 61.47,14.99
  pour Route15: -8.89,123.19 77.47,123.19 77.47,-2.54 -8.89,-2.54
  pour Bottom: -3.81,128.27 80.01,128.27 80.01,-2.54 -3.81,-2.54
  pour Top: -1.27,129.54 -1.27,-1.27 77.47,-1.27 77.47,130.81 -1.27,130.81
HOST_RESET  (via drill 0.3)
  Top 0.254: R26.2 47.97,25.53 v49.66,25.53 | v67.82,29.97 67.82,36.45 66.42,37.85 66.42,39.33 R83.2 R82.2 67.31,42.76 v67.31,42.8 | v63.25,50.67 63.06,50.86 IC2.83
  Bottom 0.254: v49.66,25.53 64.26,25.53 67.82,29.08 v67.82,29.97 | v67.31,42.8 67.31,46.61 v63.25,50.67
HOST_USB_DM  (via drill 0.35)
  Top 0.305: IC2.136 46.05,63.8 v46.35,63.5 | v49.53,4.83 49.03,5.33 J1.B7 | J1.A7 49.78,8.64 v49.4,9.02
  Bottom 0.305: v46.35,63.5 46.35,63.37 46.1,63.12 46.1,12.32 v49.4,9.02 49.4,4.95 v49.53,4.83
HOST_USB_DP  (via drill 0.35)
  Top 0.305: IC2.137 45.55,63.84 v45.21,63.5 | v48.64,8.89 49.28,8.25 J1.A6 49.35,7.12 49.35,6.72 50.03,6.04 J1.B6
  Bottom 0.305: v45.21,63.5 45.59,63.12 45.59,11.94 v48.64,8.89
INTREG_1V2
  Top 0.254: C163.1 52.07,67.76 52.55,67.28 IC2.123 52.55,63.71 | IC2.50 48.55,45.3 44.49,49.36 | IC2.29 43.05,49.36 | 43.05,49.36 44.49,49.36 | IC2.3 43.18,62.36 | IC2.139 44.55,62.58 44.33,62.36 | 44.33,62.36 44.32,62.36 43.19,62.36 43.18,62.36 | 52.55,63.71 51.2,62.36 44.33,62.36 | IC2.107 53.4,62.86 52.55,63.71 | 43.05,49.36 43.05,62.23 43.18,62.36 | IC2.81 59.61,49.86 59.56,49.91 45.04,49.91 44.49,49.36 | IC2.33 42.66,47.36 43.05,47.75 43.05,49.36
  Top 0.305: IC2.81 64.68,49.86 C159.1 | IC2.107 63.38,62.86 63.63,62.61 64.73,62.61 C160.1 | IC2.139 44.55,67.41 44.87,67.73 C164.1 | IC2.3 38.1,62.36 37.81,62.65 C161.1 C162.1 | IC2.29 38.65,49.36 38.06,49.95 C156.1 | IC2.33 38.72,47.36 37.93,46.57 C157.1 | IC2.50 48.55,39.5 C158.1
JTAG_NRST  (via drill 0.3)
  Top 0.254: R82.1 v69.34,41.91 | v68.33,51.69 69.42,51.69 70.31,50.8 TC1.10
  Bottom 0.254: v69.34,41.91 69.34,45.23 66.38,48.19 66.38,50.61 67.45,51.69 v68.33,51.69
JTAG_TCK  (via drill 0.35)
  Top 0.254: 73.13,53.34 73.03,53.34 TC1.4
  Top 0.305: IC2.89 65.52,53.86 v66.04,53.34 | 73.13,53.34 v73.41,53.34
  Bottom 0.305: v66.04,53.34 v73.41,53.34
JTAG_TDI
  Top 0.254: IC2.105 62.98,61.86 63.88,60.96 65.02,60.96 66.89,59.1 66.89,54.54 68.09,53.34 TC1.8
JTAG_TDO
  Top 0.254: IC2.109 61.19,65.35 61.26,65.28 65.4,65.28 71.11,59.58 71.11,56.63 70.48,56.01 TC1.6
JTAG_TMS  (via drill 0.3)
  Top 0.254: IC2.79 62.34,48.86 64.17,47.04 65.58,47.04 66.04,47.5 66.04,51.56 66.8,52.32 v66.93,52.32 | v72.77,52.2 72.64,52.07 71.88,52.07
  Top 0.61: TC1.2 71.88,52.07
  Bottom 0.254: v66.93,52.32 72.64,52.32 v72.77,52.2
N$1
  Top 0.254: J1.A5 48.78,7.99 48.3,8.47 R31.2
N$2
  Top 0.61: C99.2 C100.1
N$3
  Top 0.305: R95.2 11.56,77.47 | 11.56,77.47 R96.1 | C93.1 11.56,77.47
N$4
  Top 0.254: R4.2 48.16,101.18 LED1.C
N$5
  Top 0.254: IC3.4 41.99,90.94 C5.1
N$6
  Top 0.254: IC3.8 39.78,93.04 40.74,93.04 41.53,93.82 41.53,97.79 42.04,98.3 45.21,98.3 45.72,98.81 R4.1
N$7
  Top 0.254: IC3.16 35.83,95.83 C8.1
N$8
  Top 0.254: IC3.7 42.49,92.44 C3.1 C4.1 48.16,93.13 FL2.2
N$9  (via drill 0.3)
  Top 0.254: IC3.14 36.83,97.66 v36.83,97.92 36.83,98.42 35.94,99.31 35.94,100.29 C7.1 C2.1 C1.1 31.33,105.31 FL3.2 | IC3.11 38.33,96.5 v38.99,97.16
  Bottom 0.254: v38.99,97.16 37.59,97.16 v36.83,97.92
N$10  (via drill 0.3)
  Top 0.254: FL4.2 25.3,94.5 C9.1 C11.1 29.21,94.4 | 29.21,94.4 C10.1 31.44,93.44 IC3.19 | IC3.27 32.92,89.44 v32.38,88.9 | v29.21,93.34 29.21,94.4
  Bottom 0.254: v32.38,88.9 29.21,92.08 v29.21,93.34
N$11  (via drill 0.3)
  Top 0.254: IC3.35 38.33,87.4 v38.86,86.87 | v38.61,83.82 38.61,82.64 R9.1
  Bottom 0.254: v38.86,86.87 38.86,86.82 39.37,86.31 39.37,84.58 v38.61,83.82
N$13
  Top 0.254: L2.2 39.37,108.87 39.34,108.91 39.34,109.95 39.43,110.05 | 39.43,110.05 39.5,110.11 40.64,110.11 FL1.1 41.36,109.43 41.36,109.66 43.92,112.22 44.98,112.22 45.76,111.44 D1.3 | R21.2 38.14,111.34 39.43,110.05
N$14
  Top 0.254: D1.2 48.71,110.89 45.77,110.89 45.32,111.34 R19.2 41.91,108.8 | L1.2 41.91,108.8 | 41.91,108.8 41.84,108.8 41.8,108.76 40.59,108.76 FL1.2
N$15
  Top 0.254: C6.1 R3.2 R19.1
N$16
  Top 0.254: R21.1 R20.2 C13.1
N$17
  Top 0.254: FL1.4 39.94,115.42 C14.1
N$18
  Top 0.254: FL1.3 41.34,115.42 C15.1
N$19
  Top 0.254: R23.1 43.32,115.99 42.52,116.79 38.77,116.79 37.96,115.99 R22.1 C16.1 R24.2
N$20
  Top 0.254: R32.2 43.65,2.96 44.08,2.53 49.14,2.53 50.53,3.92 J1.B5
N$22
  Top 0.305: R183.2 LED13.A
N$23
  Top 0.305: R188.2 LED14.A
N$43  (via drill 0.45)
  Top 0.406: U2.11 18.84,42.88 v18.41,43.31 | v19.05,37.97 20.45,36.58 20.45,36.51
  Top 0.61: D6.1 D9.1 19.05,35.56 20,36.51 20.45,36.51 R97.2
  Bottom 0.406: v19.05,37.97 19.05,42.67 v18.41,43.31
N$67
  Top 0.203: J2.A5 65.29,7.86 64.68,8.47 R86.2
N$68
  Top 0.203: J2.B5 67.04,3.54 66.04,2.54 59.69,2.54 59.27,2.96 R87.2
N$69  (via drill 0.3)
  Top 0.254: IC4.6 60.98,18.78 v60.96,18.8 | v71.12,22.1 R85.1
  Bottom 0.254: v60.96,18.8 60.96,21.46 62.74,23.24 69.98,23.24 v71.12,22.1
N$70
  Top 0.203: R88.2 71.64,11.43 70.36,12.72 68.04,12.72 67.38,13.38 67.38,14.42 66.03,15.78 65.36,15.78 64.98,16.16 IC4.14
N$71
  Top 0.406: R90.2 LED5.A
N$72
  Top 0.406: R89.2 LED4.A
N$73
  Top 0.406: R91.2 LED6.A
N$74
  Top 0.406: R92.2 LED7.A
N$80
  Top 0.61: D4.1 7.3,31.73
  Top 1.016: D5.1 D4.1 | 7.3,31.73 C83.1 L7.1
N$81
  Top 0.61: C84.2 C85.1
N$82
  Top 0.254: 21.59,77.47 R2.1
  Top 0.305: R1.2 21.59,77.47 C90.1
N$83
  Top 0.406: U2.6 27.18,42.88 | 27.18,42.88 27.39,42.88 28.11,43.6 R98.2 C101.1 | U2.4 26.85,41.59 27.18,41.91 27.18,42.29 | 27.18,42.29 27.18,42.88 | U2.5 27.12,42.23 27.18,42.29
N$84
  Top 0.305: U3.9 34.93,22.36 35.31,22.73
  Top 0.61: 35.31,22.73 35.31,28.13 L9.2
N$85
  Top 0.406: U2.1 26.41,39.63 26.67,39.37 26.8,39.5 | U2.2 26.52,40.28 26.8,40.01 26.8,39.5 | 26.8,39.5 26.99,39.69 C102.2
  Top 1.016: 26.67,39.37 26.67,35.05 26.54,34.92 26.54,35.52 L8.1
N$86
  Top 0.254: U3.2 39.02,22.36 C106.1
N$87
  Top 0.406: U2.3 27.22,40.94 27.87,41.59 C102.1
N$91
  Top 0.254: R103.2 LED11.A
N$93
  Top 0.254: R104.2 LED12.A
N$156
  Top 0.305: R193.2 LED15.A
N$157
  Top 0.305: R197.2 LED16.A
OSCI
  Top 0.254: IC2.142 43.05,67.63 40.76,69.92 Y2.3 38.2,71.44 C22.1
OSCO
  Top 0.254: IC2.141 43.55,67.7 41.91,69.34 41.91,72.19 Y2.1 45.62,73.34 C21.1
PHY_CONFIG0
  Top 0.254: IC3.22 25.01,91.94 24.13,91.06 24.13,87.12 23.75,86.74 22.9,86.74 R6.1 R5.1
PHY_CONFIG1
  Top 0.254: IC3.21 23.01,92.44 R8.1 R7.1
PHY_RST  (via drill 0.3)
  Top 0.254: IC2.120 54.05,67.62 v53.72,67.94 | v40.51,78.87 40.22,79.16 R10.1 | IC3.3 41.13,90.44 v41.15,90.42
  Bottom 0.254: v53.72,67.94 53.34,68.33 51.13,68.33 40.59,78.87 v40.51,78.87 41.15,79.5 v41.15,90.42
PHY_TRX_M
  Top 0.254: IC3.13 37.33,97.27 39.37,99.31 L2.1 37.97,106.04 37.76,105.83 R20.1
PHY_TRX_P
  Top 0.254: IC3.12 37.83,97.23 39.75,99.16 39.75,103.88 L1.1 43.35,106.04 43.56,105.83 R3.1
PHY_XTAL_I
  Top 0.254: IC3.6 44.7,91.94 44.7,91.95 46.23,90.42 46.23,90.3 | 46.23,90.3 46.23,87.88 46.65,87.46 Y1.1 | C19.1 46.35,90.17 46.23,90.3
PHY_XTAL_O
  Top 0.254: IC3.5 44.58,91.44 45.72,90.3 45.72,84.45 46.23,83.95 48.77,83.95 49.06,84.24 | 49.06,84.24 Y1.3 | C20.1 49.06,82.6 49.06,84.24
QSPI_QCS
  Top 0.254: IC1.1 54.36,33.66 52.88,35.13 52.88,39.92 55.55,42.6 IC2.64
QSPI_QIO0
  Top 0.254: IC2.42 44.55,42.77 44.45,42.67 44.45,38.35 45.34,37.47 IC1.5
QSPI_QIO1
  Top 0.254: IC1.2 56.9,34.92 57.55,35.58 IC2.68
QSPI_QSCK
  Top 0.254: IC2.51 49.05,42.52 51.69,39.88 51.69,37.72 50.16,36.2 IC1.6
RMII_CRSDV  (via drill 0.3)
  Top 0.254: IC2.126 51.05,67.06 v50.8,67.31 50.8,71.54 R11.1 R12.1 | v34.54,95.63 34.83,95.34 IC3.18
  Bottom 0.254: v50.8,67.31 50.67,67.31 34.54,83.44 v34.54,95.63
RMII_REFCLK
  Top 0.254: IC2.1 39.13,63.36 38.23,64.26 38.23,65.91 37.21,66.93 36.2,66.93 31.37,71.75 31.37,89.58 32.23,90.44 IC3.25
RMII_RXD0  (via drill 0.3)
  Top 0.254: IC2.125 51.55,66.79 v51.69,66.93 | IC3.24 32.01,90.94 v32,90.93 32,90.88 30.86,89.74 30.86,84.75 30.35,84.24 R16.1 R15.1
  Bottom 0.254: v51.69,66.93 51.69,66.85 51.64,66.8 50.59,66.8 34.16,83.23 34.16,90.3 33.53,90.93 v32,90.93
RMII_RXD1  (via drill 0.3)
  Top 0.254: IC2.121 53.55,66.47 v53.28,66.74 | IC3.23 31.75,91.44 v31.24,90.93 31.24,90.89 30.1,89.75 R18.1 R17.1
  Bottom 0.254: v53.28,66.74 53.28,66.66 53.04,66.42 50.43,66.42 33.78,83.07 33.78,88.39 v31.24,90.93
RMII_RXER  (via drill 0.3)
  Top 0.254: IC2.119 54.55,67.12 v54.61,67.18 54.61,70.27 R13.1 R14.1 | v35.31,95.63 35.33,95.61 IC3.17
  Bottom 0.254: v54.61,67.18 53.55,67.18 52.91,67.82 50.71,67.82 34.92,83.6 34.92,95.25 v35.31,95.63
RMII_TXD0
  Top 0.254: IC2.131 48.55,66.81 49.91,68.17 49.91,76.23 40.54,85.6 38.48,85.6 37.33,86.75 IC3.33
RMII_TXD1  (via drill 0.3)
  Top 0.254: IC3.32 36.83,86.23 v37.34,85.72 | v38.86,86.11 38.99,85.98 40.7,85.98 50.29,76.39 50.29,68.01 50.04,67.76 50.04,64.77 50.05,64.78 IC2.128
  Bottom 0.254: v37.34,85.72 37.72,86.11 v38.86,86.11
RMII_TXEN
  Top 0.254: IC2.132 48.05,66.85 49.53,68.33 49.53,76.07 40.39,85.22 36.96,85.22 35.33,86.84 IC3.29
SWITCHED_IGN
  Top 0.61: J5.3 J5.4 13.97,21.27 C99.1 15.56,24.77 | 15.56,24.77 15.56,26.69 D6.2 | D8.2 20.81,23.89 19.94,24.77 15.56,24.77
UART0_RX_LED  (via drill 0.3)
  Top 0.254: R89.1 45.72,20.83 v49.66,24.77 | IC4.29 66.95,25.11 66.61,24.77 v65.28,24.77
  Bottom 0.254: v65.28,24.77 v49.66,24.77
UART0_RXD  (via drill 0.3)
  Top 0.254: IC4.16 65.98,16.44 66.29,16.13 v66.93,16.13 | v63.5,45.47 63.5,46.35 62.99,46.86 IC2.75
  Bottom 0.254: v66.93,16.13 66.93,17.19 71.63,21.89 71.63,26.88 68.32,30.18 68.32,40.64 v63.5,45.47
UART0_TX_LED  (via drill 0.3)
  Top 0.254: IC4.30 67.87,25.51 66.82,25.51 66.79,25.49 65.29,25.49 64.77,24.97 64.77,24.39 v64.64,24.26 | v49.66,23.88 48.26,22.48 R90.1
  Bottom 0.254: v64.64,24.26 50.04,24.26 v49.66,23.88
UART0_TXD
  Top 0.254: IC2.66 56.55,44.87 57.02,45.34 59.94,45.34 61.85,43.43 72.77,43.43 73.28,42.93 73.28,42.8 73.28,20.65 71.72,19.1 70.52,19.1 70.5,19.11 IC4.17
UART1_RX_LED
  Top 0.254: R91.1 50.8,23.42 52.73,25.35 53.95,25.35 55.19,24.11 IC4.54
UART1_RXD  (via drill 0.3)
  Top 0.254: IC2.73 61.55,45.85 62.36,45.85 62.74,45.47 v62.74,45.09 | v63.37,26.67 63.37,26.8 63.5,26.92 63.5,28.58 IC4.38
  Bottom 0.254: v62.74,45.09 63.37,44.45 v63.37,26.67
UART1_TX_LED  (via drill 0.3)
  Top 0.254: v59.18,23.62 58.66,23.62 58.64,23.64 56.53,23.64 IC4.55 | v52.07,23.62 51.31,22.86 51.31,20.66 R92.1
  Bottom 0.254: v59.18,23.62 58.66,23.62 58.64,23.64 58.2,23.64 58.18,23.62 v52.07,23.62
UART1_TXD  (via drill 0.3)
  Top 0.254: IC4.39 62.98,41.8 v62.36,42.42 | v57.02,63.63 57.02,65.32 IC2.114
  Bottom 0.254: v62.36,42.42 57.02,47.75 v57.02,63.63
VBATT
  Top 0.61: D7.2 7.62,22.08
  Top 1.016: J5.1 J5.2 7.13,19.54 D7.2 8.4,22.86 C84.1 | 7.62,22.08 D4.2
VBATT_PROT
  Top 0.406: U2.13 19.12,41.59 18.8,41.91 19.12,42.23 U2.12
  Top 0.61: 10.87,41.53 C86.1
  Top 1.016: L7.2 13.88,36.83 C88.1 | C87.1 13.88,34.29 L7.2 | L7.2 12.62,39.78 | 12.62,39.78 10.87,41.53 | 18.8,41.91 14.74,41.91 12.62,39.78
VEE
  Top 0.254: IC4.37 63.98,26.16 | 63.98,26.16 63.98,19.43 | 63.98,19.43 IC4.12 | IC4.49 58.12,26.61 58.2,26.69 60.95,26.69 61.48,26.16 63.98,26.16 | IC4.64 59.63,19.11 59.85,19.33 63.88,19.33 | 63.88,19.33 63.98,19.43 | C69.1 70.27,14.46 65.4,19.33 63.88,19.33
  Top 0.305: IC4.64 54.97,19.11 C68.1 | IC4.49 56.32,26.61 55.88,27.05 C67.1 | IC4.37 63.98,31.69 C70.1
VUSB  (via drill 0.65)
  Top 0.203: J1.A9 50.8,7.17 50.8,6.6 51.03,6.37 J1.B4
  Top 0.254: J1.A4 48.28,6.75 48.03,6.5 J1.B9 48.01,5.91 48.01,5.08 | J1.B4 51.03,5.23 51.18,5.08
  Top 0.61: D5.2 11.43,27.56 12.19,28.32 18.41,28.32 19.05,27.69 D9.2 19.18,26.88 19.18,26.29 19.68,25.78 20.57,25.78 22.86,23.5 22.86,8.89 26.16,5.59 45.15,5.59 45.66,5.08 48.01,5.08 48.01,4.06 v48.13,3.94 | 51.18,5.08 51.18,4.7 v51.44,4.45
  Bottom 0.61: v51.44,4.45 50.93,3.94 v48.13,3.94

## Text on the board
tNames: CAN1_H | CAN1_L | CAN0_H | CAN0_L | GND | ETH_P | ETH_N | GND | CONFIG0: / 0 = PHY is configured as Slave / 1 = PHY is configured as Master | CFG1 | ADDR1 | CFG0 | CONFIG1: / 0 = Managed operation / 1 = Autonomous operation | ADDR0 | CONFIG3/2: / 0/0 = Normal MII / 0/1 = RMII mode (external 50 MHz osc) / 1/0 = RMII mode (25 MHz crystal) / 1/1 = Reverse MII mode | CFG2 | CFG3 | DBG0 | DBG1 | DBG2 | DBG3 | 3V3 | 3V3 | 5V | 5V | VBATT | IGN | GND | GND | 5V | 3V3 | R | T | R | T | UART0 | UART1 | HOST | DEBUG